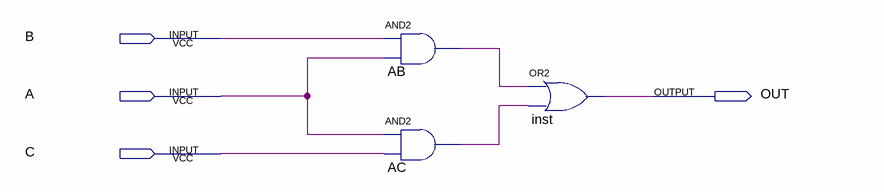
[diagram p0: schematic sheet]
// Quartus schematic display_2.bdf as structural Verilog: 3 symbols, 4 pins
module display_2 (
  input  B,
  input  A,
  input  C,
  output OUT
);

  wire AB_out, AC_out;

  and AB (AB_out, B, A);
  and AC (AC_out, A, C);
  or inst (OUT, AB_out, AC_out);
endmodule
